# Altium schematic sheet EC25 CONTROLS.SchDoc
size A; SheetNumber: 7; SheetTotal: 9
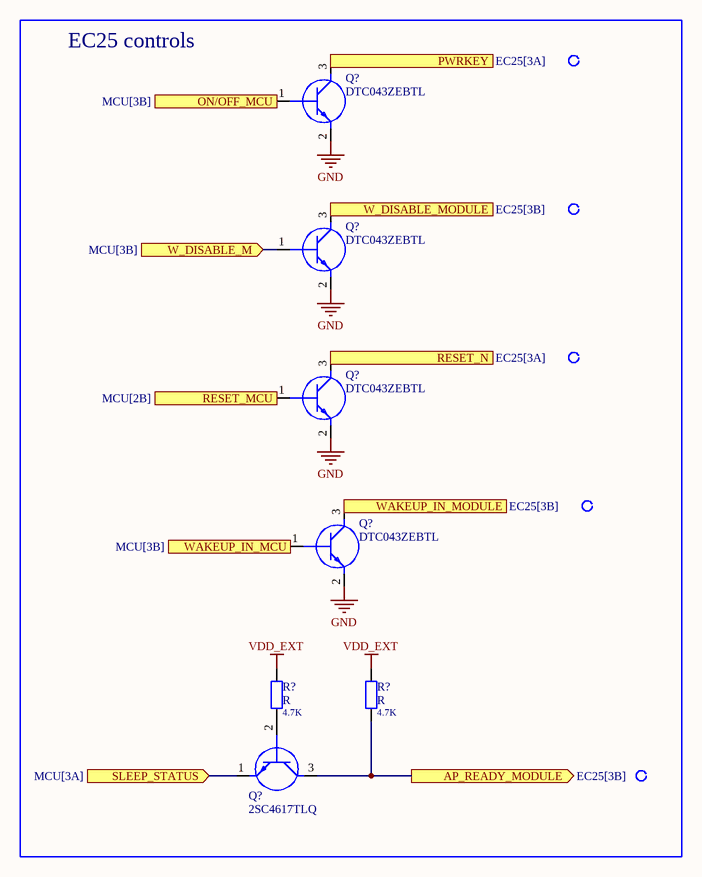
[diagram p0: EC25 CONTROLS.SchDoc]

## Parts
(Parts that share a designator on the sheet are numbered #1, #2 ... from top to bottom, then left to right.)
Q?#1  DTC043ZEBTL  [SOTFL50P160X85-3N]
Q?#2  DTC043ZEBTL  [SOTFL50P160X85-3N]
Q?#3  DTC043ZEBTL  [SOTFL50P160X85-3N]
Q?#4  DTC043ZEBTL  [SOTFL50P160X85-3N]
Q?#5  2SC4617TLQ  [2SC4617TLQ]
R?#1  R  value 4.7K  [RESC1005X04N]
R?#2  R  value 4.7K  [RESC1005X04N]

## Blocks framed on the sheet
EC25 controls: Q?#1-Q?#5 R?#1 R?#2

## Ports
AP_READY_MODULE (out, see EC25[3B]), ON/OFF_MCU (in, see MCU[3B]), PWRKEY (out, see EC25[3A]), RESET_MCU (in, see MCU[2B]), RESET_N (out, see EC25[3A]), SLEEP_STATUS (in, see MCU[3A]), W_DISABLE_M (in, see MCU[3B]), W_DISABLE_MODULE (out, see EC25[3B]), WAKEUP_IN_MCU (in, see MCU[3B]), WAKEUP_IN_MODULE (out, see EC25[3B])

## Nets
GND: Q?#1.2(E) Q?#2.2(E) Q?#3.2(E) Q?#4.2(E)
VDD_EXT: R?#1.2 R?#2.2
AP_READY_MODULE: Q?#5.3(C) R?#2.1 ; port AP_READY_MODULE
ON/OFF_MCU: Q?#1.1(B) ; port ON/OFF_MCU
PWRKEY: Q?#1.3(C) ; port PWRKEY
RESET_MCU: Q?#3.1(B) ; port RESET_MCU
RESET_N: Q?#3.3(C) ; port RESET_N
SLEEP_STATUS: Q?#5.1(E) ; port SLEEP_STATUS
W_DISABLE_M: Q?#2.1(B) ; port W_DISABLE_M
W_DISABLE_MODULE: Q?#2.3(C) ; port W_DISABLE_MODULE
WAKEUP_IN_MCU: Q?#4.1(B) ; port WAKEUP_IN_MCU
WAKEUP_IN_MODULE: Q?#4.3(C) ; port WAKEUP_IN_MODULE
NetQ?#5_2: Q?#5.2(B) R?#1.1

## Library data of the parts
Q?#1-Q?#4 = DTC043ZEBTL: Transistor BJT NPN; Manufacturer_Name: ROHM Semiconductor; Datasheet Link: http://rohmfs.rohm.com/en/products/databook/datasheet/discrete/transistor/digital/dtc043zmt2l-e.pdf; Height: 0.85mm; Manufacturer_Part_Number: DTC043ZEBTL; Mouser Part Number: 755-DTC043ZEBTL; Mouser Price/Stock: https://www.mouser.co.uk/ProductDetail/ROHM-Semiconductor/DTC043ZEBTL?qs=n7vHx8wJlDGyWrBOh0icRQ%3D%3D
Q?#5 = 2SC4617TLQ: Transistor BJT NPN; Manufacturer_Name: ROHM Semiconductor; Datasheet Link: https://componentsearchengine.com/Datasheets/1/2SC4617TLQ.pdf; Height: 0.8mm; Manufacturer_Part_Number: 2SC4617TLQ; Mouser Part Number: 755-2SC4617TLQ; Mouser Price/Stock: https://www.mouser.co.uk/ProductDetail/ROHM-Semiconductor/2SC4617TLQ?qs=4kLU8WoGk0sY2QY7rUsyQw%3D%3D
R?#1 R?#2 = R: MPN: *; Link: *